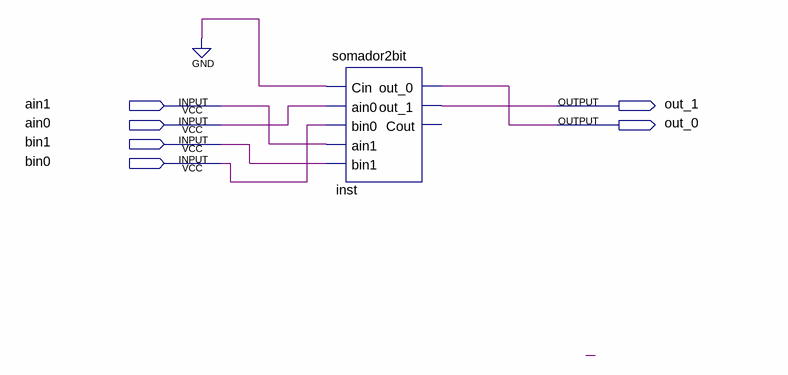
[diagram p0: schematic sheet]
// Quartus schematic ula2b.bdf as structural Verilog: 1 symbols, 6 pins
module ula2b (
  input  ain1,
  input  ain0,
  input  bin1,
  input  bin0,
  output out_1,
  output out_0
);

  somador2bit inst (
    .Cin(1'b0), .ain0(ain0), .bin0(bin0), .ain1(ain1), .bin1(bin1), .out_0(out_0), .out_1(out_1));  // open: Cout
endmodule
